# EAGLE design schematics (EAGLE 7.0.0)
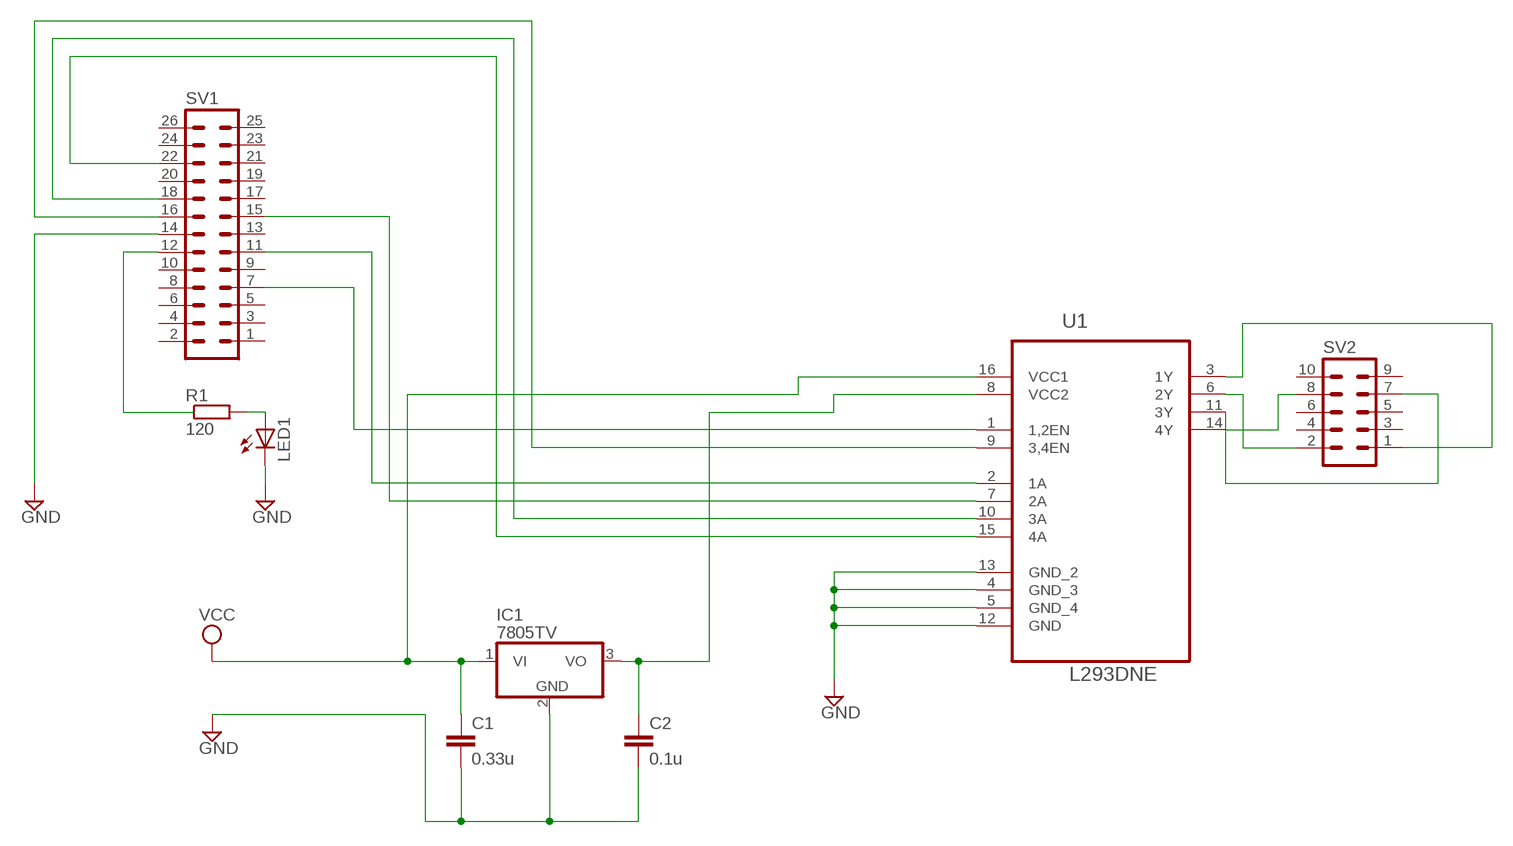
[diagram p0: schematic, sheet 1]

## Parts
C1  0.33u  C-EU025-025X050  [C025-025X050]
C2  0.1u  C-EU025-025X050  [C025-025X050]
IC1  7805TV  [TO220V]
LED1  LED5MM  [LED5MM]
R1  120  R-EU_0207/10  [0207/10]
SV1  MA13-2  [MA13-2]
SV2  MA05-2  [MA05-2]
U1  L293DNE  [DIP254P762X508-16]

## Nets
GND: C1.2 C2.2 IC1.2(GND) LED1.K(C) SV1.14 U1.4(GND_3) U1.5(GND_4) U1.12(GND) U1.13(GND_2)
N$1: SV1.7 U1.1(1,2EN)
N$2: C2.1 IC1.3(VO) U1.8(VCC2)
N$3: SV1.11 U1.2(1A)
N$4: LED1.A R1.2
N$5: SV1.15 U1.7(2A)
N$6: SV1.16 U1.9(3,4EN)
N$7: SV1.18 U1.10(3A)
N$8: SV1.22 U1.15(4A)
N$10: SV2.1 U1.3(1Y)
N$11: SV2.2 U1.6(2Y)
N$12: SV2.8 U1.14(4Y)
N$13: SV2.7 U1.11(3Y)
N$14: R1.1 SV1.12
VCC: C1.1 IC1.1(VI) U1.16(VCC1)
Unconnected: SV1.1 SV1.2 SV1.3 SV1.4 SV1.5 SV1.6 SV1.8 SV1.9 SV1.10 SV1.13 SV1.17 SV1.19 SV1.20 SV1.21 SV1.23 SV1.24 SV1.25 SV1.26 SV2.3 SV2.4 SV2.5 SV2.6 SV2.9 SV2.10

## Library data of the parts
C1 C2 = resistor:C-EU: CAPACITOR, European symbol
IC1 = linear:78*: Positive VOLTAGE REGULATOR Source: http://cache.national.com/ds/LM/LM78L05.pdf http://www.fairchildsemi.com/ds/LM/LM7805.pdf
LED1 = led:LED: LED OSRAM: - CHIPLED LG R971, LG N971, LY N971, LG Q971, LY Q971, LO R971, LY R971 LH N974, LH R974 LS Q976, LO Q976, LY Q976 LO Q996 - Hyper CHIPLED LW Q18S LB Q993, LB Q99A, LB R99A - SideLED LS A670, LO A670, LY A670, LG A670, LP A670 LB A673, LV A673, LT A673, LW A673 LH A674 LY A675 LS A676, LA A676, LO A676, LY A676, LW A676 LS A679, LY A679, LG A679 - Hyper Micro SIDELED® LS Y876, LA Y876, LO Y876, LY Y876 LT Y87S - SmartLED LW L88C, LW L88S LB L89C, LB L89S, LG L890 LS L89K, LO L89K, LY L89K LS L896, LA L896, LO L896, LY L896 - TOPLED LS T670, LO T670, LY T670, LG T670, LP T670 LSG T670, LSP T670, LSY T670, LOP T670, LYG T670 LG T671, LOG T671, LSG T671 LB T673, LV T673, LT T673, LW T673 LH T674 LS T676, LA T676, LO T676, LY T676, LB T676, LH T676, LSB T676, LW T676 LB T67C, LV T67C, LT T67C, LS T67K, LO T67K, LY T67K, LW E67C LS E67B, LA E67B, LO E67B, LY E67B, LB E67C, LV E67C, LT E67C LW T67C LS T679, LY T679, LG T679 LS T770, LO T770, LY T770, LG T770, LP T770 LB T773, LV T773, LT T773, LW T773 LH T774 LS E675, LA E675, LY E675, LS T675 LS T776, LA T776, LO T776, LY T776, LB T776 LHGB T686 LT T68C, LB T68C - Hyper Mini TOPLED® LB M676 - Mini TOPLED Santana® LG M470 LS M47K, LO M47K, LY M47K Source: http://www.osram.convergy.de LUXEON: - LUMILED® LXK2-PW12-R00, LXK2-PW12-S00, LXK2-PW14-U00, LXK2-PW14-V00 LXK2-PM12-R00, LXK2-PM12-S00, LXK2-PM14-U00 LXK2-PE12-Q00, LXK2-PE12-R00, LXK2-PE12-S00, LXK2-PE14-T00, LXK2-PE14-U00 LXK2-PB12-K00, LXK2-PB12-L00, LXK2-PB12-M00, LXK2-PB14-N00, LXK2-PB14-P00, LXK2-PB14-Q00 LXK2-PR12-L00, LXK2-PR12-M00, LXK2-PR14-Q00, LXK2-PR14-R00 LXK2-PD12-Q00, LXK2-PD12-R00, LXK2-PD12-S00 LXK2-PH12-R00, LXK2-PH12-S00 LXK2-PL12-P00, LXK2-PL12-Q00, LXK2-PL12-R00 Source: www.luxeon.com KINGBRIGHT: KA-3528ASYC Source: www.kingbright.com
R1 = resistor:R-EU_: RESISTOR, European symbol
SV1 = con-lstb:MA13-2: PIN HEADER; OC_FARNELL: unknown; OC_NEWARK: unknown
SV2 = con-lstb:MA05-2: PIN HEADER; OC_FARNELL: unknown; OC_NEWARK: unknown
U1 = Texas Instruments_By_element14_Batch_1:L293DNE: QUADRUPLE HALF-H DRIVERS; MPN: L293DNE; OC_FARNELL: 1470423; OC_NEWARK: 06F9523; PACKAGE: PDIP-16; SUPPLIER: Texas Instruments

## Board
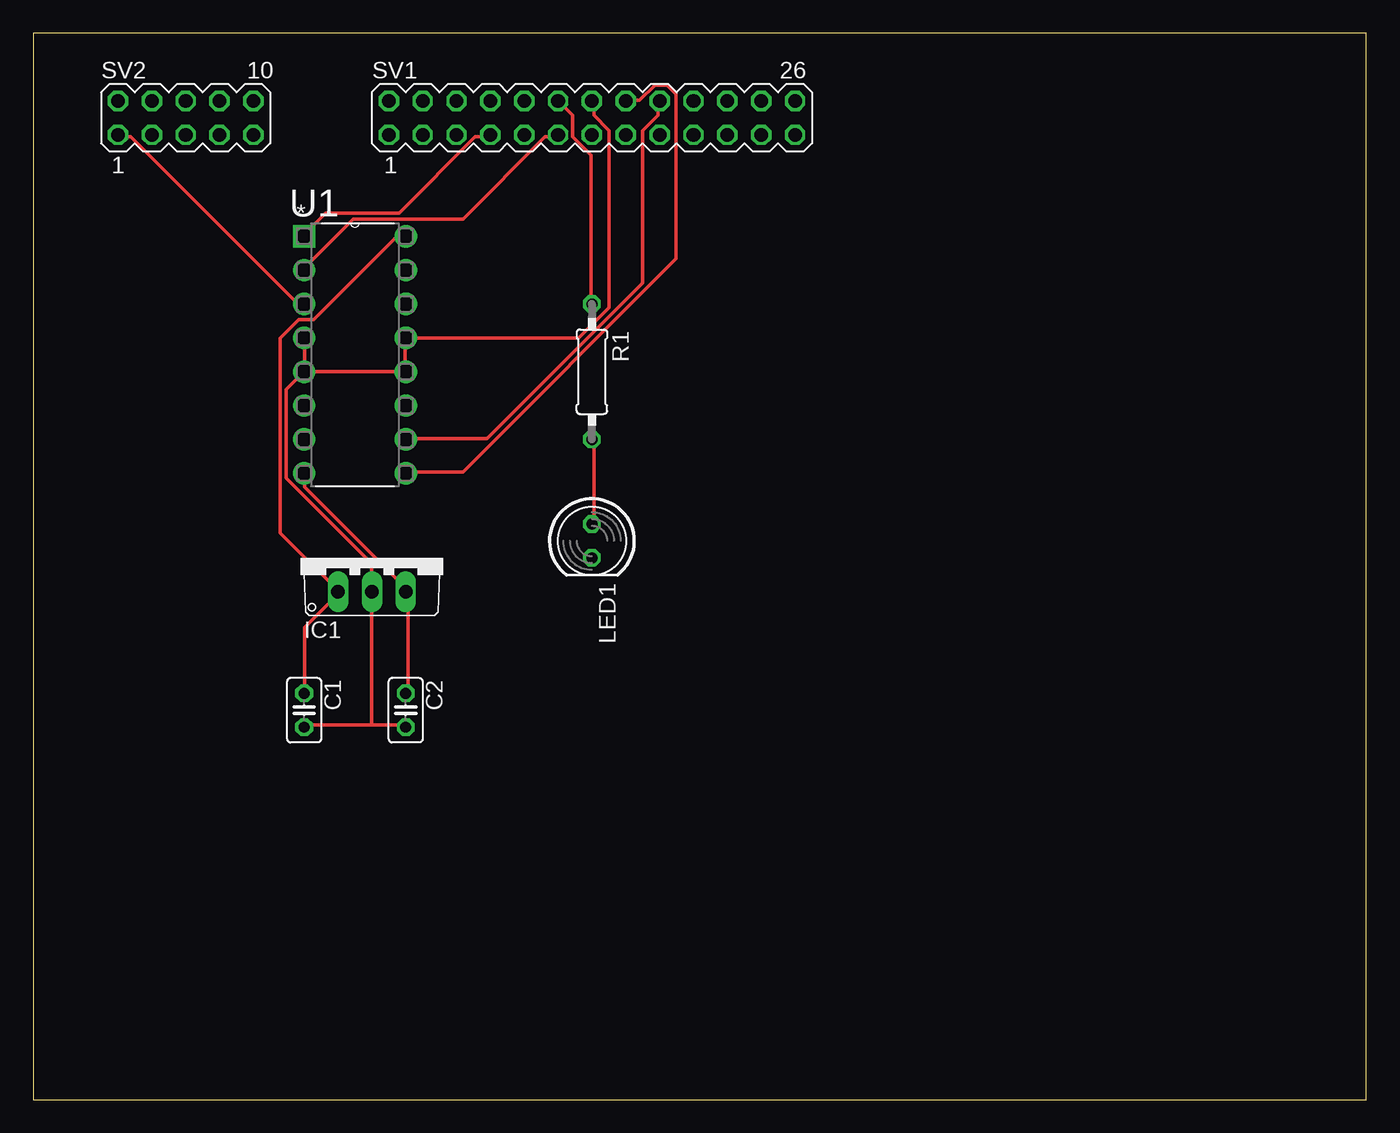
[diagram p1: board, top side]
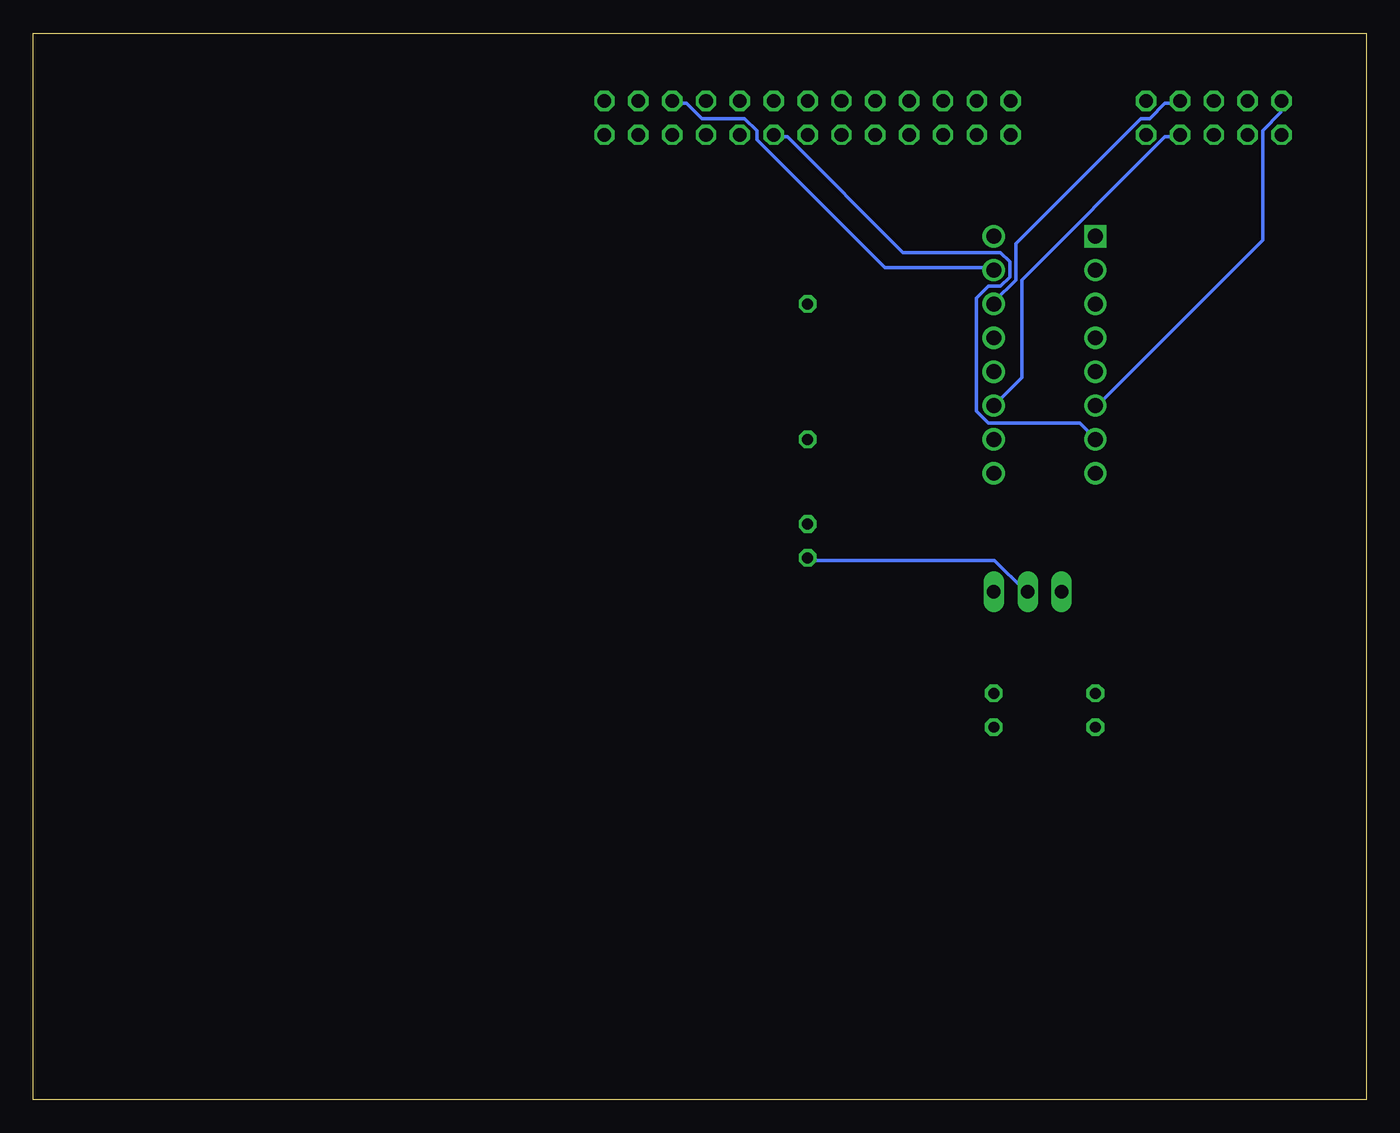
[diagram p2: board, bottom side, seen from below]

Size 100 x 80 mm. Coordinates in mm from the lower left corner, seen from the top.
Outline: 0,0 100,0 100,80 0,80 0,0
Copper layers (1*16): Top 0.035mm / dielectric 1.5mm / Bottom 0.035mm
Design rules "default": minimum track width 10mil, minimum drill 24mil, track to track 8mil, track to pad 8mil, pad to pad 8mil, via to via 8mil, smd to smd 8mil, copper to edge 40mil, drill to drill 8mil, minimum pad ring 10mil, minimum via ring 8mil, stop-mask expansion 4mil, vias tented up to drill 0mil, thermal gap 10mil

### Footprints (pad centres in the part's own frame; a part is rotated, then mirrored left to right if it is on the bottom)
C025-025X050 = drill 0.813 octagon: 1 -1.27,0; 2 1.27,0
TO220V = drill 1.016 long: 1 -2.54,-2.54; 2 0,-2.54; 3 2.54,-2.54
LED5MM = drill 0.813 octagon: A -1.27,0; K 1.27,0
0207/10 = drill 0.813 octagon: 1 -5.08,0; 2 5.08,0
MA13-2 = drill 1.016 octagon: 1 -15.24,-1.27; 2 -15.24,1.27; 3 -12.7,-1.27; 4 -12.7,1.27; 5 -10.16,-1.27; 6 -10.16,1.27; 7 -7.62,-1.27; 8 -7.62,1.27; 9 -5.08,-1.27; 10 -5.08,1.27; 11 -2.54,-1.27; 12 -2.54,1.27; 13 0,-1.27; 14 0,1.27; 15 2.54,-1.27; 16 2.54,1.27; 17 5.08,-1.27; 18 5.08,1.27; 19 7.62,-1.27; 20 7.62,1.27; 21 10.16,-1.27; 22 10.16,1.27; 23 12.7,-1.27; 24 12.7,1.27; 25 15.24,-1.27; 26 15.24,1.27
MA05-2 = drill 1.016 octagon: 1 -5.08,-1.27; 2 -5.08,1.27; 3 -2.54,-1.27; 4 -2.54,1.27; 5 0,-1.27; 6 0,1.27; 7 2.54,-1.27; 8 2.54,1.27; 9 5.08,-1.27; 10 5.08,1.27
DIP254P762X508-16 = drill 1.118 square: 1 -7.62,17.78 | drill 1.118: 2 -7.62,15.24; 3 -7.62,12.7; 4 -7.62,10.16; 5 -7.62,7.62; 6 -7.62,5.08; 7 -7.62,2.54; 8 -7.62,0; 9 0,0; 10 0,2.54; 11 0,5.08; 12 0,7.62; 13 0,10.16; 14 0,12.7; 15 0,15.24; 16 0,17.78

### Placement (x,y rotation side)
C1  20.32,29.21 270 top
C2  27.94,29.21 270 top
IC1  25.4,40.64 0 top
LED1  41.91,41.91 270 top
R1  41.91,54.61 270 top
SV1  41.91,73.66 0 top
SV2  11.43,73.66 0 top
U1  27.94,46.99 0 top

### Tracks (layer width: path | path; a pad name or v marks a point on that pad's centre or on a via)
GND
  Top 0.254: 25.38,28.12 27.89,28.12 C2.2 | 25.38,28.12 20.34,28.12 C1.2 | 25.38,28.12 25.38,37.95 IC1.2 25.38,38.18 25.38,40.23 18.97,46.63 18.97,53.26 U1.5 20.34,54.63 | 20.34,54.63 20.34,57.15 U1.4 | SV1.14 42.06,74.75 42.06,73.84 43.2,72.69 43.2,59.44 40.92,57.15 U1.13 27.89,57.15 27.89,54.63 | 27.89,54.63 20.34,54.63 | 27.89,54.63 U1.12
  Bottom 0.254: LED1.K 41.83,40.46 27.89,40.46 25.6,38.18 IC1.2
N$1
  Top 0.254: SV1.7 34.29,72.24 33.15,72.24 27.43,66.52 21.95,66.52 20.34,64.92 U1.1
N$2
  Top 0.254: C2.1 28.12,30.63 28.12,37.95 IC1.3 28.12,38.18 20.34,45.95 20.34,46.86 U1.8
N$3
  Top 0.254: SV1.11 39.32,72.24 38.41,72.24 32.23,66.06 24,66.06 20.34,62.41 U1.2
N$4
  Top 0.254: LED1.A 42.06,43.2 42.06,49.38 R1.2
N$5
  Bottom 0.254: SV1.15 44.35,72.24 43.43,72.24 34.75,63.55 27.43,63.55 26.75,62.87 26.75,61.72 27.43,61.04 28.35,61.04 29.26,60.12 29.26,51.66 28.35,50.75 21.49,50.75 20.34,49.61 U1.7
N$6
  Top 0.254: SV1.16 44.58,74.98 45.49,74.98 46.63,76.12 47.55,76.12 48.23,75.44 48.23,63.09 32.23,47.09 28.12,47.09 U1.9
N$7
  Top 0.254: SV1.18 46.86,74.75 46.86,73.84 45.72,72.69 45.72,61.27 34.06,49.61 28.12,49.61 U1.10
N$8
  Bottom 0.254: SV1.22 51.89,74.75 50.98,74.75 49.84,73.61 46.63,73.61 45.72,72.69 45.72,72.01 36.12,62.41 28.12,62.41 U1.15
N$10
  Top 0.254: SV2.1 6.4,72.24 7.32,72.24 19.66,59.89 20.12,59.89 U1.3
N$11
  Bottom 0.254: SV2.2 6.4,74.75 6.4,74.07 7.77,72.69 7.77,64.47 20.12,52.12 U1.6
N$12
  Bottom 0.254: SV2.8 14.17,74.75 15.09,74.75 16.23,73.61 16.92,73.61 26.29,64.24 26.29,61.49 27.89,59.89 U1.14
N$13
  Bottom 0.254: U1.11 25.83,54.18 25.83,61.49 15.09,72.24 14.17,72.24 SV2.7
N$14
  Top 0.254: SV1.12 40.46,73.84 40.46,72.24 41.83,70.87 41.83,59.89 R1.1
VCC
  Top 0.254: C1.1 20.34,30.63 20.34,35.43 22.86,37.95 IC1.1 22.86,38.18 18.52,42.52 18.52,57.15 19.89,58.52 21.03,58.52 27.2,64.69 27.89,64.69 U1.16